# Altium schematic sheet [4]_Output_Feedback_2.SchDoc: Output & Feedback 2
size A4; DocumentNumber: 4; SheetNumber: 4; SheetTotal: 8
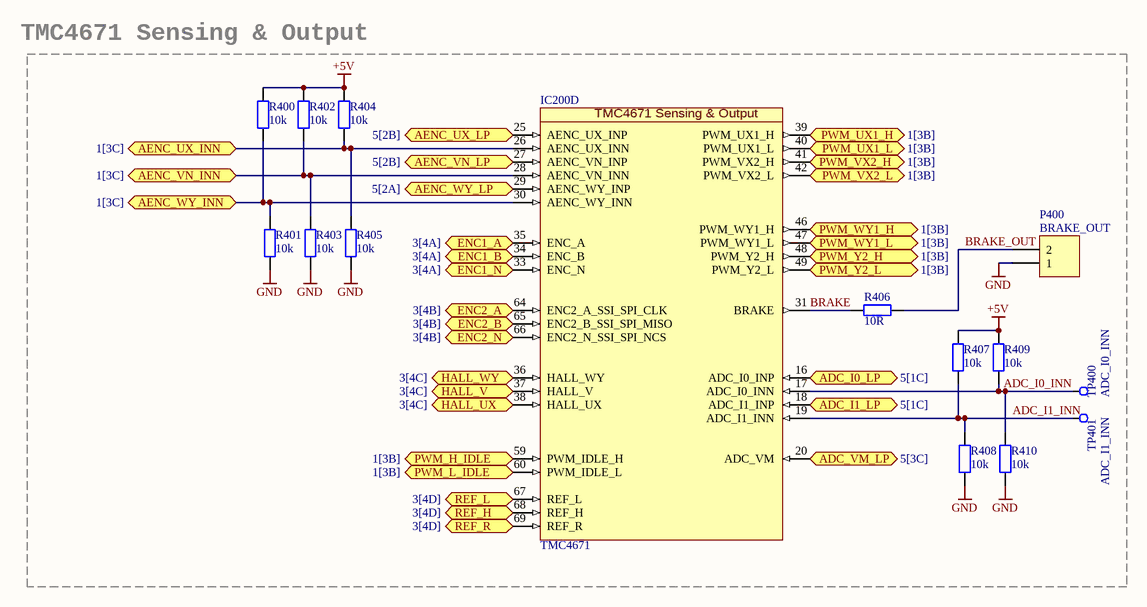
[diagram p0: [4]_Output_Feedback_2.SchDoc]

## Parts
IC200  TMC4671  [QFN40P1050X650X90_HS-77N]  (part D of 5)
P400  BRAKE_OUT  [TH_HDR_1X2]
R400  10k  [R0603]
R401  10k  [R0603]
R402  10k  [R0603]
R403  10k  [R0603]
R404  10k  [R0603]
R405  10k  [R0603]
R406  10R  [R0603]
R407  10k  [R0603]
R408  10k  [R0603]
R409  10k  [R0603]
R410  10k  [R0603]
TP400  ADC_I0_INN  [TP_SMD_1.2MM_ROUND]  (no BOM)
TP401  ADC_I1_INN  [TP_SMD_1.2MM_ROUND]  (no BOM)

## Ports
ADC_I0_LP (see 5[1C]), ADC_I1_LP (see 5[1C]), ADC_VM_LP (in, see 5[3C]), AENC_UX_INN (see 1[3C]), AENC_UX_LP (see 5[2B]), AENC_VN_INN (see 1[3C]), AENC_VN_LP (see 5[2B]), AENC_WY_INN (see 1[3C]), AENC_WY_LP (see 5[2A]), ENC1_A (see 3[4A]), ENC1_B (see 3[4A]), ENC1_N (see 3[4A]), ENC2_A (see 3[4B]), ENC2_B (see 3[4B]), ENC2_N (see 3[4B]), HALL_UX (see 3[4C]), HALL_V (see 3[4C]), HALL_WY (see 3[4C]), PWM_H_IDLE (see 1[3B]), PWM_L_IDLE (see 1[3B]), PWM_UX1_H (see 1[3B]), PWM_UX1_L (see 1[3B]), PWM_VX2_H (see 1[3B]), PWM_VX2_L (see 1[3B]), PWM_WY1_H (see 1[3B]), PWM_WY1_L (see 1[3B]), PWM_Y2_H (see 1[3B]), PWM_Y2_L (see 1[3B]), REF_H (see 3[4D]), REF_L (see 3[4D]), REF_R (see 3[4D])

## Nets
+5V: R400.2 R402.2 R404.2 R407.2 R409.2
GND: P400.1 R401.1 R403.1 R405.1 R408.1 R410.1
ADC_I0_INN: IC200.17(ADC_I0_INN) R409.1 R410.2 TP400.1
ADC_I0_LP: IC200.16(ADC_I0_INP) ; port ADC_I0_LP
ADC_I1_INN: IC200.19(ADC_I1_INN) R407.1 R408.2 TP401.1
ADC_I1_LP: IC200.18(ADC_I1_INP) ; port ADC_I1_LP
ADC_VM_LP: IC200.20(ADC_VM) ; port ADC_VM_LP
AENC_UX_INN: IC200.26(AENC_UX_INN) R404.1 R405.2 ; port AENC_UX_INN
AENC_UX_LP: IC200.25(AENC_UX_INP) ; port AENC_UX_LP
AENC_VN_INN: IC200.28(AENC_VN_INN) R402.1 R403.2 ; port AENC_VN_INN
AENC_VN_LP: IC200.27(AENC_VN_INP) ; port AENC_VN_LP
AENC_WY_INN: IC200.30(AENC_WY_INN) R400.1 R401.2 ; port AENC_WY_INN
AENC_WY_LP: IC200.29(AENC_WY_INP) ; port AENC_WY_LP
BRAKE: IC200.31(BRAKE) R406.2
BRAKE_OUT: P400.2 R406.1
ENC1_A: IC200.35(ENC_A) ; port ENC1_A
ENC1_B: IC200.34(ENC_B) ; port ENC1_B
ENC1_N: IC200.33(ENC_N) ; port ENC1_N
ENC2_A: IC200.64(ENC2_A_SSI_SPI_CLK) ; port ENC2_A
ENC2_B: IC200.65(ENC2_B_SSI_SPI_MISO) ; port ENC2_B
ENC2_N: IC200.66(ENC2_N_SSI_SPI_NCS) ; port ENC2_N
HALL_UX: IC200.38(HALL_UX) ; port HALL_UX
HALL_V: IC200.37(HALL_V) ; port HALL_V
HALL_WY: IC200.36(HALL_WY) ; port HALL_WY
PWM_H_IDLE: IC200.59(PWM_IDLE_H) ; port PWM_H_IDLE
PWM_L_IDLE: IC200.60(PWM_IDLE_L) ; port PWM_L_IDLE
PWM_UX1_H: IC200.39(PWM_UX1_H) ; port PWM_UX1_H
PWM_UX1_L: IC200.40(PWM_UX1_L) ; port PWM_UX1_L
PWM_VX2_H: IC200.41(PWM_VX2_H) ; port PWM_VX2_H
PWM_VX2_L: IC200.42(PWM_VX2_L) ; port PWM_VX2_L
PWM_WY1_H: IC200.46(PWM_WY1_H) ; port PWM_WY1_H
PWM_WY1_L: IC200.47(PWM_WY1_L) ; port PWM_WY1_L
PWM_Y2_H: IC200.48(PWM_Y2_H) ; port PWM_Y2_H
PWM_Y2_L: IC200.49(PWM_Y2_L) ; port PWM_Y2_L
REF_H: IC200.68(REF_H) ; port REF_H
REF_L: IC200.67(REF_L) ; port REF_L
REF_R: IC200.69(REF_R) ; port REF_R

## Notes on the sheet
- TMC4671 Sensing & Output
- Title:
- Size:
- Date:
- A4
- Project:
- Time:
- Sheet
- Version:
- of
- File:
- (in symbol TMC4671, part D) TMC4671 Sensing & Output

## Library data of the parts
IC200 = TMC4671: MF: TRINAMIC; MPN: TMC4671
P400 = Header 2: Header, 2-Pin
R400-R405 R407-R410 = R, 10 kohm, 50 V, 0603 [1608 Metric], 63 mW, ± 1%, MC Series: SMD Chip Resistor, Thick Film, 10 kohm, 50 V, 0603 [1608 Metric], 63 mW, ± 1%, MC Series; MPN: MC0063W0603110K; VoltageRating: 50V; Temp coefficient: *ppm; PowerRating: 63mW; MF: MULTICOMP; Precision: 1%; Resistance: 10k
R406 = R, 10 ohm, 50 V, 0603 [1608 Metric], 100 mW, ± 1%, MCWR Series: SMD Chip Resistor, Thick Film, 10 ohm, 50 V, 0603 [1608 Metric], 100 mW, ± 1%, MCWR Series; MPN: MC0063W0603110K; VoltageRating: 50V; Temp coefficient: *ppm; PowerRating: 100mW; MF: MULTICOMP; Precision: 1%; Resistance: 10R
TP400 TP401 = TP_SMD_Xmm: SMD testpoint, 1.2mm pad, round